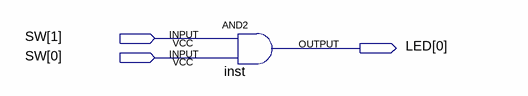
[diagram p0: schematic sheet]
// Quartus schematic Fpga.bdf as structural Verilog: 1 symbols, 3 pins
module Fpga (
  input  [1:0] SW,
  output [0:0] LED
);

  and inst (LED[0], SW[1], SW[0]);
endmodule
